# Altium schematic sheet 16SVPE180M1_16SVPE180M.schdoc
size 124 x 101 mm
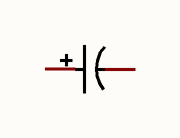
[diagram p0: 16SVPE180M1_16SVPE180M.schdoc]

## Parts
C?  180uF  [CAP-SMD_BD6.3-L6.6-W6.6-LS7.3-FD]  (value not drawn)

## Nets

Not connected (* = marked no-connect by the designer): C? 1 2

## Library data of the parts
C? = 16SVPE180M: Manufacturer: PANASONIC(松下); Add into BOM: yes; Tolerance: ±20%; Rated Voltage: 16V; Ripple Current: 4.46A@100kHz; Equivalent Series Resistance(ESR): 11mΩ@100kHz; Type: 聚合物; φD: 6.3mm; L: 10mm; Lifetime @ Temp: 2000hrs@105℃; Symbol: 16SVPE180M; Device: 16SVPE180M; LCSC Part Name: 180uF ±20% 16V; Supplier Part: C88141; Manufacturer Part: 16SVPE180M; Supplier Footprint: SMD,D6.3xL10mm; JLCPCB Part Class: Extended Part; Datasheet: https://atta.szlcsc.com/upload/public/pdf/source/20171113/C88141_15105616557631116145.pdf; Supplier: LCSC; Convert to PCB: yes; Value: 180uF; Lead Spacing: -; Operating Temperature: -55℃~+105℃